# EAGLE design MySens-easyRS485-v001 (EAGLE 7.3.0)
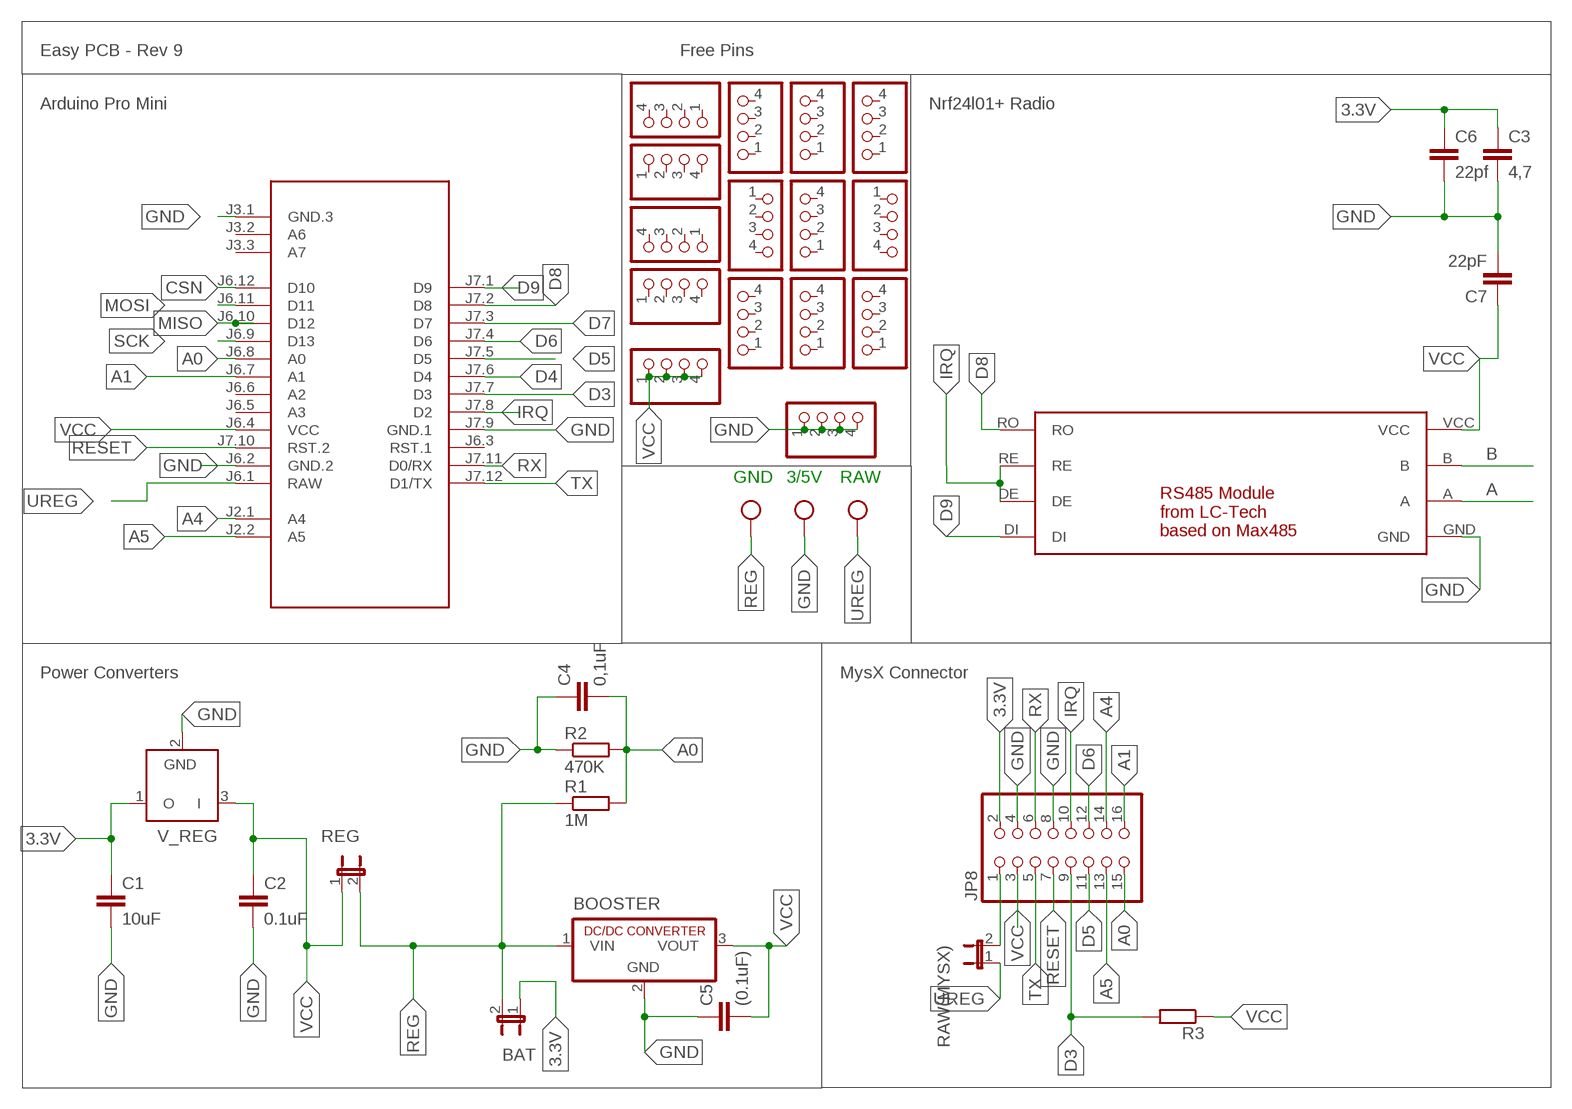
[diagram p0: schematic, sheet 1]

## Parts
.  W237-103  [W237-103]
BAT  JP1E  [JP1]
BOOSTER  R-78C1.8-1.0  [SIP3]
C1  10uF  C5/2.5  [C5B2.5]
C2  0.1uF  C5/2.5  [C5B2.5]
C3  4,7  C5/2.5  [C5B2.5]
C4  0,1uF  C5/2.5  [C5B2.5]
C5  (0.1uF)  C5/2.5  [C5B2.5]
C6  22pf  C-EUC0805  [C0805]
C7  22pF  C-EUC0805  [C0805]
JP1  PINHD-1X04_2.54-S  [1X04-S]
JP2  PINHD-1X04_2.54-S  [1X04-S]
JP3  PINHD-1X04_2.54-S  [1X04-S]
JP4  PINHD-1X04_2.54-S  [1X04-S]
JP5  PINHD-1X04_2.54-S  [1X04-S]
JP6  PINHD-1X04_2.54-S  [1X04-S]
JP7  PINHD-1X04_2.54-S  [1X04-S]
JP8  PINHD-2X08_2.54  [2X08]
JP9  PINHD-1X04_2.54-S  [1X04-S]
JP10  PINHD-1X04_2.54-S  [1X04-S]
JP11  PINHD-1X04_2.54-S  [1X04-S]
JP12  PINHD-1X04_2.54-S  [1X04-S]
JP13  PINHD-1X04_2.54-S  [1X04-S]
JP14  PINHD-1X04_2.54-S  [1X04-S]
JP15  PINHD-1X04_2.54-S  [1X04-S]
JP16  PINHD-1X04_2.54-S  [1X04-S]
M1  ARDUINO-PRO-MINI-3.3V#NP  [ARDUINO-PRO-MINI#NP]
R1  1M  R-EU_0204/7  [0204/7]
R2  470K  R-EU_0204/7  [0204/7]
R3  R-EU_0204/7  [0204/7]
RAW(MYSX)  JP1E  [JP1]
REG  JP1E  [JP1]
U$1  RS485-LCTECH  [RS485-LCTECH]
V_REG  LP2950Z  [TO92]

## Nets
3.3V [Power]: BAT.1 C1.1 C3.1 C6.1 JP8.2 V_REG.1(O)
A: U$1.A
A0: C4.2 JP8.15 M1.J6.8(A0) R1.2 R2.2
A1: JP8.16 M1.J6.7(A1)
A4: JP8.14 M1.J2.1(A4)
A5: JP8.13 M1.J2.2(A5)
B: U$1.B
CSN: M1.J6.12(D10)
D3: JP8.9 M1.J7.7(D3) R3.2
D4: M1.J7.6(D4)
D5: JP8.11 M1.J7.5(D5)
D6: JP8.12 M1.J7.4(D6)
D7: M1.J7.3(D7)
D8: M1.J7.2(D8) U$1.RO
D9: M1.J7.1(D9) U$1.DI
GND [Power]: ..2 BOOSTER.2(GND) C1.2 C2.2 C3.2 C4.1 C5.1 C6.2 C7.2 JP1.1 JP1.2 JP1.3 JP1.4 JP8.4 JP8.8 M1.J3.1(GND.3) M1.J6.2(GND.2) M1.J7.9(GND.1) R2.1 U$1.GND V_REG.2(GND)
IRQ: JP8.10 M1.J7.8(D2) U$1.DE U$1.RE
MISO: M1.J6.10(D12)
MOSI: M1.J6.11(D11)
N$1: JP8.1 RAW(MYSX).2
REG [Power]: ..3 BAT.2 BOOSTER.1(VIN) R1.1 REG.2
RESET: JP8.7 M1.J7.10(RST.2)
RX: JP8.6 M1.J7.11(D0/RX)
SCK: M1.J6.9(D13)
TX: JP8.5 M1.J7.12(D1/TX)
UREG [Power]: ..1 M1.J6.1(RAW) RAW(MYSX).1
VCC [Power]: BOOSTER.3(VOUT) C2.1 C5.2 C7.1 JP3.1 JP3.2 JP3.3 JP3.4 JP8.3 M1.J6.4(VCC) R3.1 REG.1 U$1.VCC V_REG.3(I)
Unconnected: JP2.1 JP2.2 JP2.3 JP2.4 JP4.1 JP4.2 JP4.3 JP4.4 JP5.1 JP5.2 JP5.3 JP5.4 JP6.1 JP6.2 JP6.3 JP6.4 JP7.1 JP7.2 JP7.3 JP7.4 JP9.1 JP9.2 JP9.3 JP9.4 JP10.1 JP10.2 JP10.3 JP10.4 JP11.1 JP11.2 JP11.3 JP11.4 JP12.1 JP12.2 JP12.3 JP12.4 JP13.1 JP13.2 JP13.3 JP13.4 JP14.1 JP14.2 JP14.3 JP14.4 JP15.1 JP15.2 JP15.3 JP15.4 JP16.1 JP16.2 JP16.3 JP16.4 M1.J3.2(A6) M1.J3.3(A7) M1.J6.3(RST.1) M1.J6.5(A3) M1.J6.6(A2)

## Notes on the sheet
- Easy PCB - Rev 9 | Free Pins
- Arduino Pro Mini | Nrf24l01+ Radio
- GND | 3/5V | RAW
- Power Converters | MysX Connector

## Library data of the parts
. = con-wago-500:W237-103: WAGO SCREW CLAMP; MPN: 237-103; OC_FARNELL: unknown; OC_NEWARK: 18M7116
BAT RAW(MYSX) REG = jumper:JP1E: JUMPER
BOOSTER = dc-dc-converter:R-78C*-1.0: INNOLINE DC/DC-Converter 1.0 AMP SIP3 Single Output Source: Data sheet <http://www.mikrocontroller.net/attachment/150645/157764-da-01-en-DC_DC_WANDLER_R_78C5_0_1_0.pdf>
C1-C5 = capacitor-wima:C: CAPACITOR naming: grid - package width
C6 C7 = rcl:C-EU: CAPACITOR, European symbol
JP1-JP7 JP9-JP16 = pinhead-2:PINHD-1X04: PIN HEADER
JP8 = pinhead-2:PINHD-2X08: PIN HEADER
M1 = diy-modules:ARDUINO-PRO-MINI-*#NP: Arduino Pro Mini without programming pads
R1-R3 = rcl:R-EU_: RESISTOR, European symbol
U$1 = Martin:RS485-LCTECH: RS485 Module from LC-Tech based on Max485
V_REG = linear:LP2950: 100 mA, Low Power Low Dropout Voltage Regulator Source: http://www.onsemi.com/pub/Collateral/LP2950-D.PDF

## Net classes
0 default: width 0.305 mm
1 Power: width 0.61 mm

## Board
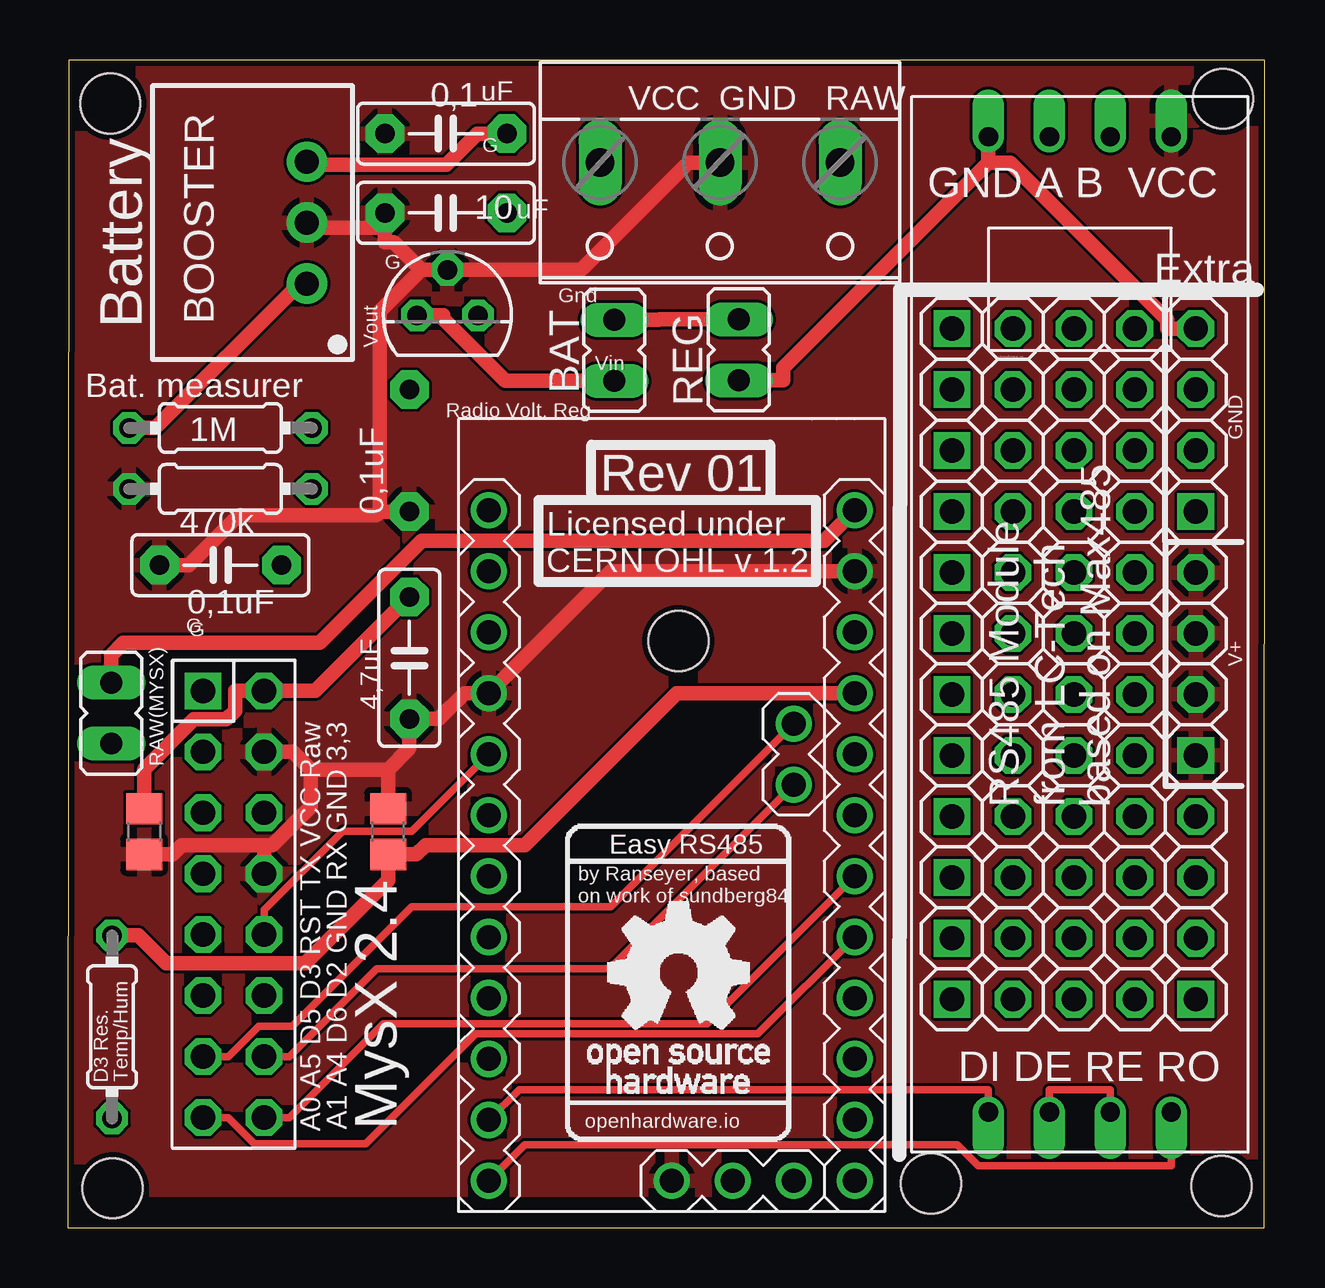
[diagram p1: board, top side]
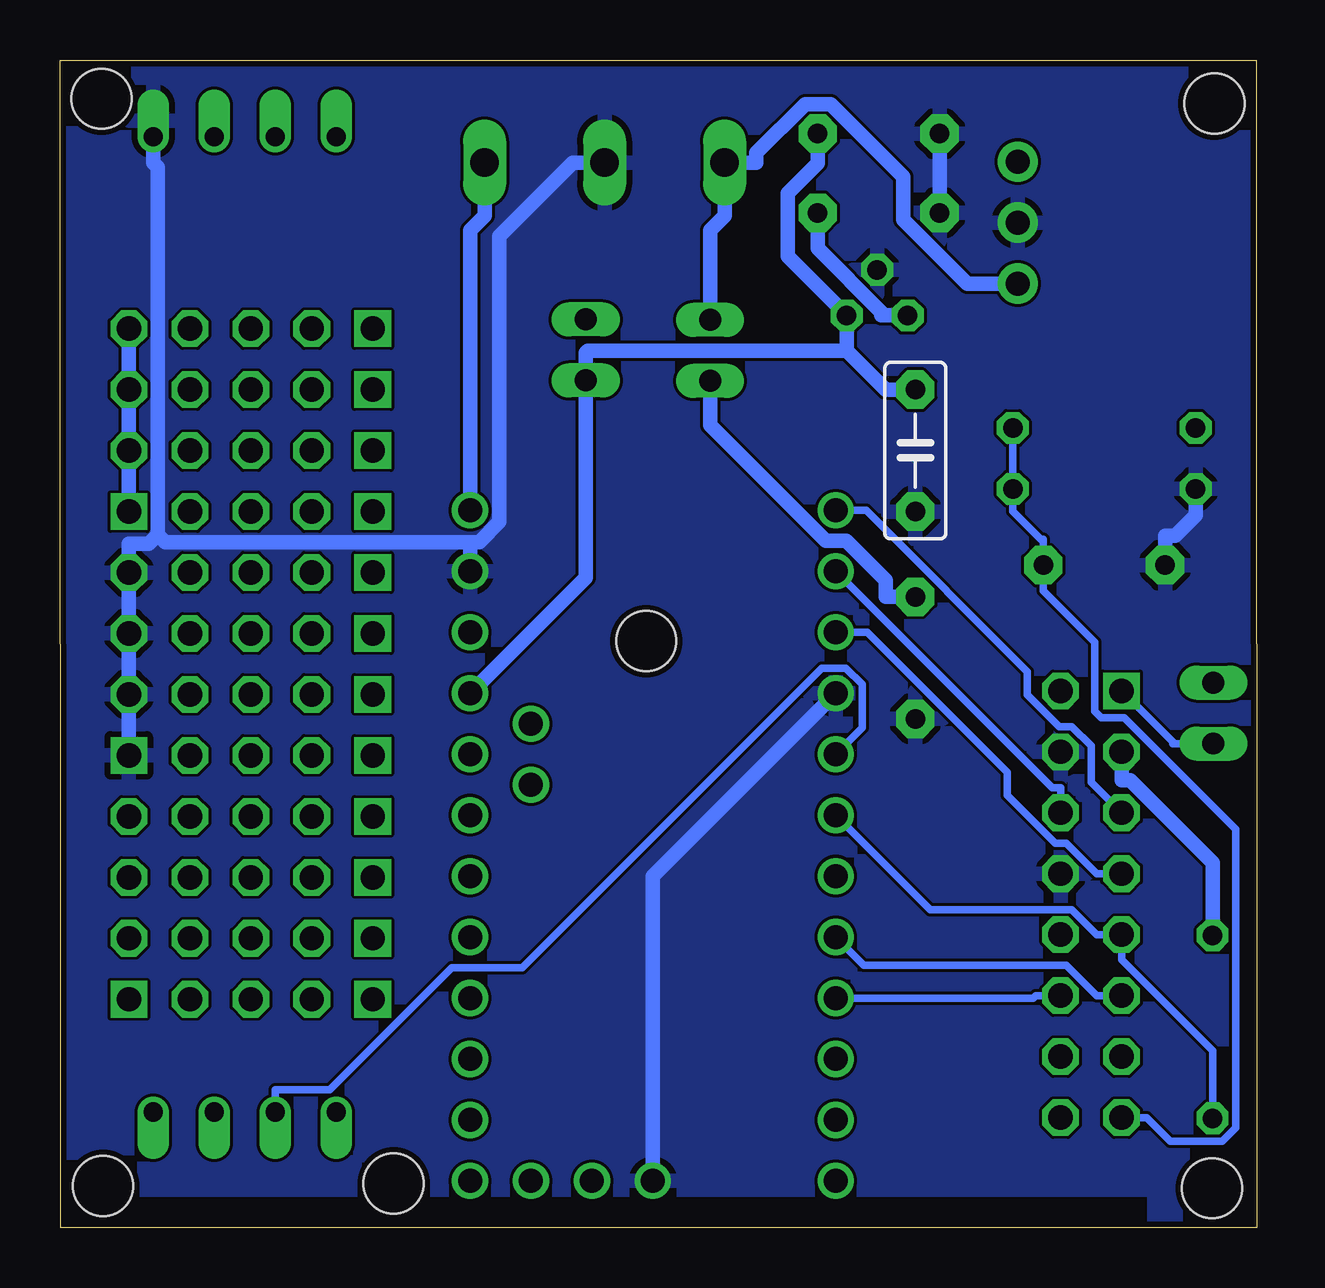
[diagram p2: board, bottom side, seen from below]

Size 49.86 x 48.66 mm. Coordinates in mm from the lower left corner, seen from the top.
Outline: 0,0 49.84,0 49.86,48.66 0.03,48.66 0,0
Copper layers (1*16): Top 0.035mm / dielectric 1.5mm / Bottom 0.035mm
Design rules "dirt_cheap_dirty_boards.v1": minimum track width 5mil, minimum drill 12mil, track to track 5mil, track to pad 5mil, pad to pad 5mil, via to via 5mil, smd to smd 0mil, copper to edge 10mil, drill to drill 10mil, minimum pad ring 10mil, minimum via ring 6mil, stop-mask expansion 2mil, vias tented up to drill 25mil, thermal gap 10mil
Holes 2.5 mm at 48.06,1.75 35.96,1.85 1.86,1.65 1.76,46.85 48.13,47.05 25.43,24.45
tRestrict: area 2.7,0.8 to 49.4,1.3
bRestrict: area 4.6,0.5 to 49.5,1.3

### Footprints (pad centres in the part's own frame; a part is rotated, then mirrored left to right if it is on the bottom)
W237-103 = drill 1.194 long: 1 -5,-1.29; 2 0,-1.29; 3 5,-1.29
JP1 = drill 0.914 long: 1 0,-1.27; 2 0,1.27
SIP3 = drill 1 pad 1.676: 1 -2.54,0; 2 0,0; 3 2.54,0
C5B2.5 = drill 0.813 pad 1.6 octagon: 1 -2.54,0; 2 2.54,0
C0805 = smd 1.3 x 1.5: 1 -0.95,0; 2 0.95,0
1X04-S = drill 1.016 square: 1 -3.81,0 | drill 1.016 octagon: 2 -1.27,0; 3 1.27,0; 4 3.81,0
2X08 = drill 1.016 square: 1 -8.89,-1.27 | drill 1.016 octagon: 2 -8.89,1.27; 3 -6.35,-1.27; 4 -6.35,1.27; 5 -3.81,-1.27; 6 -3.81,1.27; 7 -1.27,-1.27; 8 -1.27,1.27; 9 1.27,-1.27; 10 1.27,1.27; 11 3.81,-1.27; 12 3.81,1.27; 13 6.35,-1.27; 14 6.35,1.27; 15 8.89,-1.27; 16 8.89,1.27
ARDUINO-PRO-MINI#NP = drill 1: J2.1 -1.27,5.08; J2.2 -3.81,5.08; J3.1 15.24,0; J3.2 15.24,2.54; J3.3 15.24,5.08; J6.1 -12.7,7.62; J6.2 -10.16,7.62; J6.3 -7.62,7.62; J6.4 -5.08,7.62; J6.5 -2.54,7.62; J6.6 0,7.62; J6.7 2.54,7.62; J6.8 5.08,7.62; J6.9 7.62,7.62; J6.10 10.16,7.62; J6.11 12.7,7.62; J6.12 15.24,7.62; J7.1 15.24,-7.62; J7.2 12.7,-7.62; J7.3 10.16,-7.62; J7.4 7.62,-7.62; J7.5 5.08,-7.62; J7.6 2.54,-7.62; J7.7 0,-7.62; J7.8 -2.54,-7.62; J7.9 -5.08,-7.62; J7.10 -7.62,-7.62; J7.11 -10.16,-7.62; J7.12 -12.7,-7.62
0204/7 = drill 0.813 octagon: 1 -3.81,0; 2 3.81,0
RS485-LCTECH = drill 0.8 offset: A 20.32,-1.27; B 20.32,1.27; DE -20.32,-1.27; DI -20.32,-3.81; GND 20.32,-3.81; RE -20.32,1.27; RO -20.32,3.81; VCC 20.32,3.81
TO92 = drill 0.813 octagon: 1 -1.27,0; 2 0,1.905; 3 1.27,0

### Placement (x,y rotation side)
.  27.17,43.09 180 top
BAT  22.77,36.56 0 top
BOOSTER  9.96,41.88 90 top
C1  15.75,42.29 180 top
C2  15.75,45.59 180 top
C3  14.22,23.75 270 top
C4  6.35,27.61 0 top
C5  14.22,32.39 90 bottom
C6  3.17,16.51 270 top
C7  13.34,16.51 90 top
JP1  46.99,23.5 90 top
JP2  40.64,32.39 0 top
JP3  46.99,33.66 90 top
JP4  46.99,13.34 90 top
JP5  40.64,27.31 0 top
JP6  40.64,24.77 0 top
JP7  40.64,14.61 0 top
JP8  6.9,13.49 270 top
JP9  40.64,9.53 0 top
JP10  40.64,17.14 0 top
JP11  40.64,29.85 0 top
JP12  40.64,12.07 0 top
JP13  40.64,19.68 0 top
JP14  40.64,22.23 0 top
JP15  40.64,34.93 0 top
JP16  40.64,37.47 0 top
M1  25.16,17.2 270 top
R1  6.35,33.33 0 top
R2  6.35,30.79 0 top
R3  1.83,8.38 270 top
RAW(MYSX)  1.8,21.45 180 top
REG  27.95,36.59 0 top
U$1  42.16,25.15 90 top
V_REG  15.81,38.02 0 top

### Tracks (layer width: path | path; a pad name or v marks a point on that pad's centre or on a via)
3.3V
  Top 0.61: C6.1 3.17,19.12 5.24,21.18 6.6,21.18 6.98,21.55 6.98,22.38 JP8.2 10.31,22.38 C3.1 | V_REG.1 15.63,38.02 15.63,37.88 18.22,35.29 BAT.1
  Bottom 0.61: C3.1 15.46,26.29 15.46,26.98 17.1,28.63 17.95,28.63 22.77,33.45 BAT.1 | V_REG.1 15.63,38.02 15.63,38.16 18.29,40.81 C1.1
A0
  Top 0.305: M1.J6.8 28.74,8.08 16.99,8.08 12.41,3.5 7.77,3.5 6.67,4.6 JP8.15
  Bottom 0.305: JP8.15 4.59,4.6 3.6,3.61 1.43,3.61 0.88,4.16 0.88,16.62 5.52,21.25 6.47,21.25 6.75,21.53 6.75,24.39 8.89,26.54 C4.2 8.89,28.7 9.01,28.7 10.16,29.85 R2.2 R1.2
A1
  Top 0.305: JP8.16 9.21,4.6 13.13,8.51 26.63,8.51 M1.J6.7
A4
  Top 0.305: 22.56,10.79 12.87,10.79 9.21,7.14 JP8.14 | 22.56,10.79 | 22.56,10.79 M1.J2.1
A5
  Top 0.305: JP8.13 6.67,7.14 7.94,8.41 9.34,8.41 14.32,13.39 22.62,13.39 M1.J2.2
D3
  Bottom 0.305: R3.2 1.83,7.38 5.63,11.17 JP8.9 6.67,12.21 7.71,13.26 13.6,13.26 M1.J7.7
D5
  Bottom 0.305: JP8.11 6.67,9.68 7.94,10.95 16.36,10.95 M1.J7.5
D6
  Bottom 0.305: JP8.12 9.21,9.68 9.31,9.58 M1.J7.4
D8
  Top 0.305: U$1.RO 38.35,5.76 18.8,5.76 M1.J7.2
D9
  Top 0.305: U$1.DI 45.97,2.58 37.93,2.58 37.05,3.46 19.04,3.46 M1.J7.1
GND
  Top 0.61: M1.J6.2 22.62,27.36 M1.J7.9 16.52,22.28 15.46,21.21 C3.2 14.22,19.98 13.34,19.09 | C6.2 4.36,15.56 4.75,15.95 8.17,15.95 | 10.11,19.09 10.11,17.54 8.52,15.95 8.17,15.95 | 10.11,19.09 9.36,19.84 JP8.4 | 13.34,19.09 10.11,19.09 | JP8.8 8.17,15.95 | 14.72,39.92 12.99,38.19 12.99,29.85 | 14.72,39.92 13.58,41.06 13.21,41.06 13.21,41.68 | 13.21,41.68 10.17,41.68 BOOSTER.2 | C1.2 13.21,41.68 | 14.72,39.92 V_REG.2 21.38,39.92 25.84,44.39 ..2 | C7.2 13.34,19.09 | C4.1 5.04,27.61 7.12,29.7 12.85,29.7 12.99,29.85 | C5.1 12.99,29.85
  Bottom 0.61: C1.2 C2.2 | 32.78,28.57 45.47,28.57 45.78,28.89 | 32.78,28.57 32.4,28.57 31.56,29.41 31.56,41.33 28.5,44.39 ..2 | M1.J6.2 32.78,28.57 | 45.78,28.89 45.78,44.19 45.97,44.38 U$1.GND | 45.78,28.89 46.17,28.5 46.99,28.5 JP1.4 JP1.3 JP1.2 JP1.1 | M1.J3.1 25.16,14.66 M1.J7.9 | C4.1 3.81,28.85 3.39,28.85 2.54,29.7 R2.1
  pour Top: 0,48.26 0,0 49.53,0 49.53,48.26
  pour Bottom: 0,0 49.53,0 49.53,48.26 0,48.26
IRQ
  Top 0.305: U$1.DE 43.43,5.76 40.89,5.76 U$1.RE | JP8.10 8.17,13.26 11.44,16.53 14.33,16.53 M1.J7.8
  Bottom 0.305: U$1.RE 40.89,5.76 38.61,5.76 33.53,10.85 30.6,10.85 18.12,23.32 17.12,23.32 16.44,22.64 16.44,20.83 M1.J7.8
N$1
  Bottom 0.305: RAW(MYSX).2 3.5,20.18 3.5,20.25 JP8.1
REG
  Top 0.61: R1.1 3.63,33.33 9.65,39.34 BOOSTER.1 | BAT.2 24.62,37.83 24.65,37.86 REG.2
  Bottom 0.61: BAT.2 22.77,41.56 22.17,42.16 ..3 20.84,44.39 20.84,44.8 18.82,46.83 17.75,46.83 14.72,43.8 14.72,42 12.06,39.34 BOOSTER.1
RESET
  Bottom 0.305: JP8.7 6.67,14.75 7.94,16.03 8.4,16.03 10.39,18.02 10.39,18.97 16.23,24.82 M1.J7.10
RX
  Bottom 0.305: JP8.6 8.17,18.34 8.52,18.34 M1.J7.11
TX
  Bottom 0.305: M1.J7.12 16.27,29.9 9.55,23.18 9.55,22.21 8.21,20.88 7.7,20.88 6.9,20.08 6.9,18.57 JP8.5
UREG
  Top 0.61: M1.J6.1 31.51,28.63 14.75,28.63 10.49,24.37 2.31,24.37 1.8,23.86 RAW(MYSX).1
  Bottom 0.61: ..1 32.17,42.16 32.78,41.56 M1.J6.1
VCC
  Top 0.61: M1.J6.4 25.37,22.28 19.04,15.95 14.9,15.95 14.52,15.56 C7.1 13.34,14.48 9.88,11.02 4.09,11.02 2.93,12.18 R3.1 | C2.1 17.06,45.59 15.77,44.3 10.08,44.3 BOOSTER.3 | REG.1 29.81,35.32 29.81,35.84 38.35,44.38 | 38.35,44.38 39.25,44.38 45.8,37.84 45.8,37.47 JP3.4 | U$1.VCC 38.35,44.38
  Bottom 0.61: JP8.3 5.63,18.64 5.26,18.64 1.83,15.22 R3.1 | M1.J6.4 27.95,27.1 REG.1 27.95,36.46 27.86,36.55 17.08,36.55 | 17.08,36.55 15.46,34.93 C5.2 | 17.08,36.55 V_REG.3 19.54,40.47 19.54,43.11 18.29,44.36 C2.1 | JP3.1 JP3.2 JP3.3 JP3.4

### Text on the board
tPlace: uF | uF | Gnd | Vout | Vin | Licensed under / CERN OHL v.1.2 | Easy RS485 | by Ranseyer, based / on work of sundberg84 | MysX 2.4 | openhardware.io
tNames: 0,1 | VCC GND RAW | G | 10 | G | Extra | Battery | C:/Users/Sundberg/Desktop/open.bmp | Bat. measurer | Radio Volt. Reg | 1M | GND | Rev 01 | 0,1uF | 470k | 0,1uF | G | G | V+ | 4,7uF | D3 Res. | Temp/Hum | A0 A5 D5 D3 RST TX VCC Raw | A1 A4 D6 D2 GND RX GND 3,3